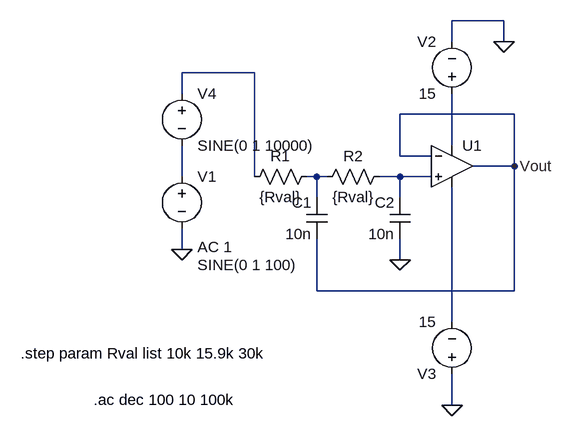
[diagram p0: schematic LPF.asc]
LPF.asc, the LTspice schematic file:
Version 4.1
SHEET 1 880 680
WIRE 0 -80 -80 -80
WIRE -80 -48 -80 -80
WIRE 0 -48 0 -80
WIRE -384 0 -496 0
WIRE -496 32 -496 0
WIRE 16 64 -160 64
WIRE -80 112 -80 32
WIRE -160 128 -160 64
WIRE -112 128 -160 128
WIRE 16 144 16 64
WIRE 16 144 -48 144
WIRE -496 160 -496 112
WIRE -384 160 -384 0
WIRE -288 160 -304 160
WIRE -272 160 -288 160
WIRE -160 160 -192 160
WIRE -112 160 -160 160
WIRE -288 192 -288 160
WIRE -160 192 -160 160
WIRE -496 272 -496 240
WIRE -160 288 -160 256
WIRE -288 336 -288 256
WIRE 16 336 16 144
WIRE 16 336 -288 336
WIRE -80 384 -80 176
WIRE -80 512 -80 464
FLAG -496 272 0
FLAG -160 288 0
FLAG 0 -48 0
FLAG -80 512 0
FLAG 16 144 Vout
SYMBOL OpAmps\\UniversalOpAmp2 -80 144 R0
SYMATTR InstName U1
SYMBOL res -288 144 R90
WINDOW 0 0 56 VBottom 2
WINDOW 3 32 56 VTop 2
SYMATTR InstName R1
SYMATTR Value {Rval}
SYMBOL res -176 144 R90
WINDOW 0 0 56 VBottom 2
WINDOW 3 32 56 VTop 2
SYMATTR InstName R2
SYMATTR Value {Rval}
SYMBOL cap -272 256 R180
WINDOW 0 24 56 Left 2
WINDOW 3 24 8 Left 2
SYMATTR InstName C1
SYMATTR Value 10n
SYMBOL cap -144 256 R180
WINDOW 0 24 56 Left 2
WINDOW 3 24 8 Left 2
SYMATTR InstName C2
SYMATTR Value 10n
SYMBOL voltage -496 144 R0
WINDOW 3 24 152 Left 2
WINDOW 123 24 124 Left 2
WINDOW 39 0 0 Left 0
SYMATTR Value SINE(0 1 100)
SYMATTR Value2 AC 1
SYMATTR InstName V1
SYMBOL voltage -80 48 R180
WINDOW 0 24 96 Left 2
WINDOW 3 24 16 Left 2
WINDOW 123 0 0 Left 0
WINDOW 39 0 0 Left 0
SYMATTR InstName V2
SYMATTR Value 15
SYMBOL voltage -80 480 R180
WINDOW 123 0 0 Left 0
WINDOW 39 0 0 Left 0
SYMATTR InstName V3
SYMATTR Value 15
SYMBOL voltage -496 16 R0
WINDOW 123 0 0 Left 0
WINDOW 39 0 0 Left 0
SYMATTR InstName V4
SYMATTR Value SINE(0 1 10000)
TEXT -632 504 Left 2 !.ac dec 100 10 100k
TEXT -744 432 Left 2 !.step param Rval list 10k 15.9k 30k

The netlist it stands for:
* LPF.asc
X§U1 N005 Vout N002 N006 Vout level2 Avol=1Meg GBW=10Meg Slew=10Meg Ilimit=25m Rail=0 Vos=0 En=0 Enk=0 In=0 Ink=0 Rin=500Meg  ; pins In+ In- V+ V- OUT
R1 N004 N001 {Rval}
R2 N005 N004 {Rval}
C1 Vout N004 10n
C2 0 N005 10n
V1 N003 0 SINE(0 1 100) AC 1
V2 N002 0 15
V3 0 N006 15
V4 N001 N003 SINE(0 1 10000)
.ac dec 100 10 100k
.step param Rval list 10k 15.9k 30k
.lib UniversalOpAmp2.lib
.backanno
.end